# Altium project PCB_Stm.PrjPcb
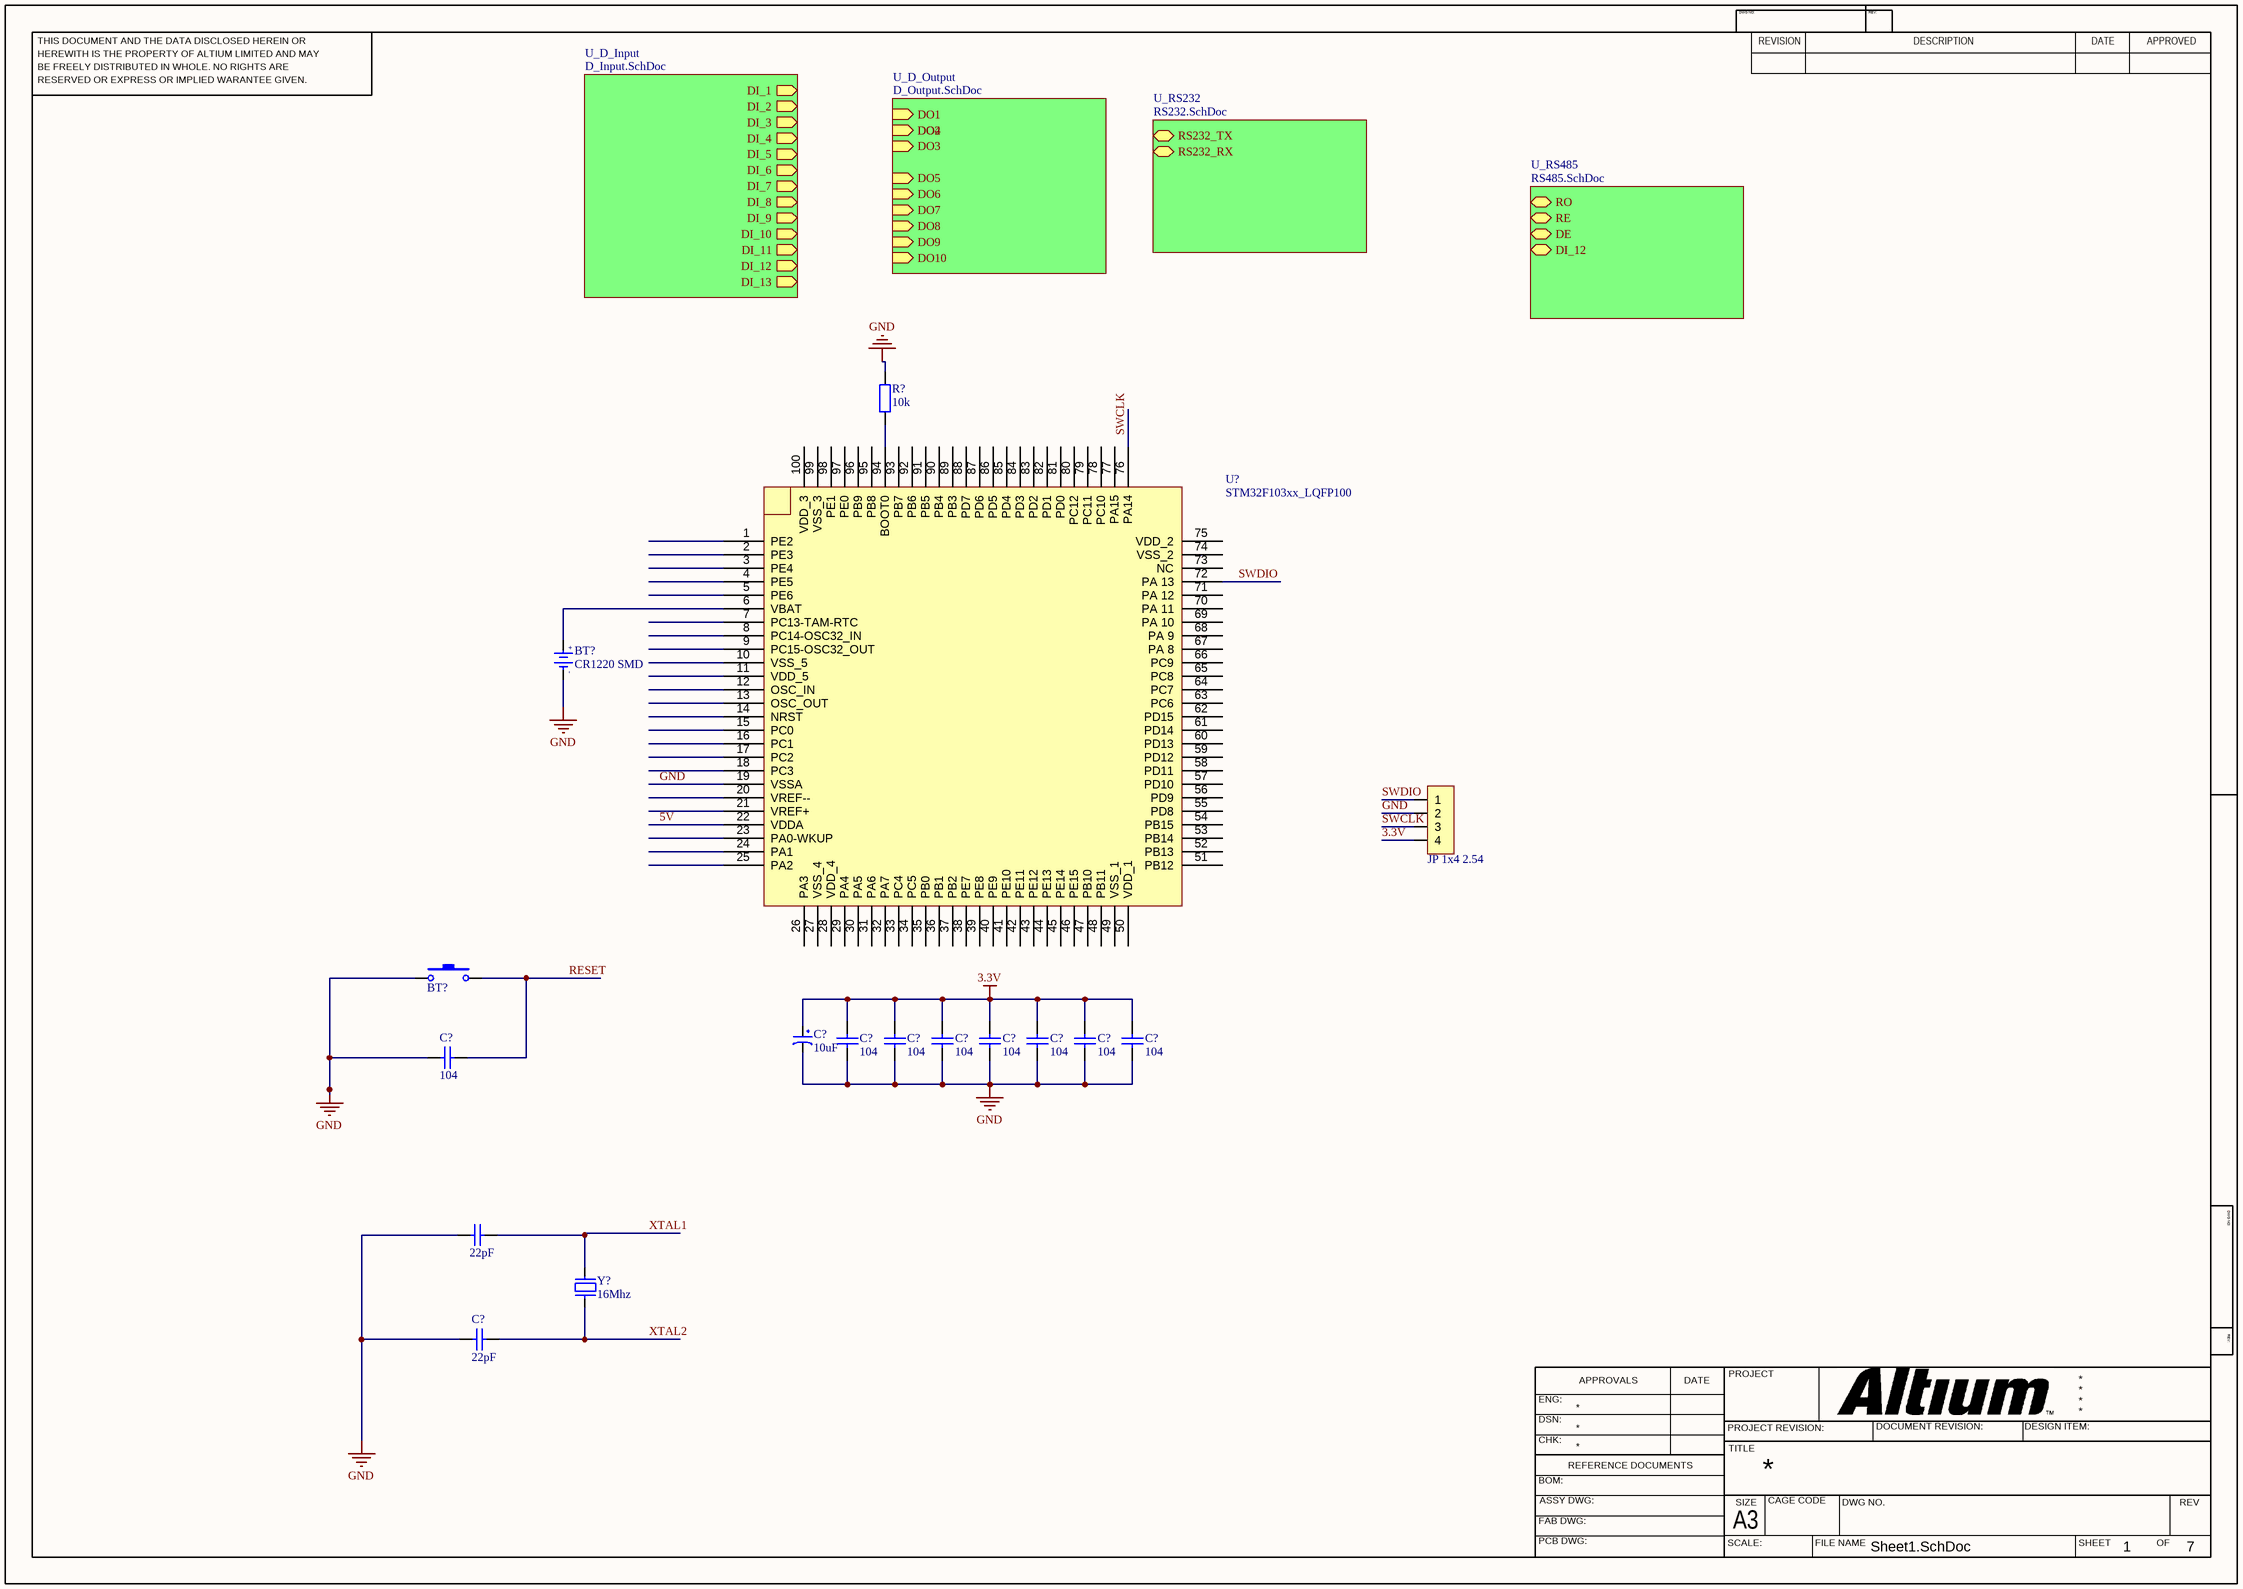
[diagram p0: Sheet1.SchDoc]
6 sheets, 106 parts. Net scope: hierarchical (ports join the sheet entries above them; power ports are global).
Board file: PCB1.PcbDoc
Sheets:
  Sheet1.SchDoc
    U_D_Input = D_Input.SchDoc
    U_D_Output = D_Output.SchDoc
    U_RS232 = RS232.SchDoc
  A_Input.SchDoc
  PWM_Output.SchDoc

## Sheet Sheet1.SchDoc
size 420 x 297 mm; SheetNumber: 1; SheetTotal: 7

### Parts
(Parts that share a designator on the sheet are numbered #1, #2 ... from top to bottom, then left to right.)
?  22pF  [tu 0805]
BT?#1  CR1220 SMD  [DE PIN CR1220]
BT?#2  Nut Nhan 2 Chan SMD 3x6x2.5  [Nut Nhan 2 Chan SMD 3x6x2.5]  (value not drawn)
C?#1  10uF  [tu tantalum smd3528]
C?#2  104  [tu 0805]
C?#3  104  [tu 0805]
C?#4  104  [tu 0805]
C?#5  104  [tu 0805]
C?#6  104  [tu 0805]
C?#7  104  [tu 0805]
C?#8  104  [tu 0805]
C?#9  104  [tu 0805]
C?#10  22pF  [tu 0805]
JP?  JP 1x4 2.54  [JP 1x4 DC]
R?#1  10k  [tro smd 0805]
U?#1  STM32F103xx_LQFP100  [STM32_LQFP100]
Y?  16Mhz  [Thach Anh 2 chan SMD]

### Sub-sheets
U_D_Input = D_Input.SchDoc: DI_1 (out), DI_2 (out), DI_3 (out), DI_4 (out), DI_5 (out), DI_6 (out), DI_7 (out), DI_8 (out), DI_9 (out), DI_10 (out), DI_11 (out), DI_12 (out), DI_13 (out)
U_D_Output = D_Output.SchDoc: DO1 (in), DO2 (in), DO3 (in), DO4 (in), DO5 (in), DO6 (in), DO7 (in), DO8 (in), DO9 (in), DO10 (in)
U_RS232 = RS232.SchDoc: RS232_TX (bidir), RS232_RX (bidir)
U_RS485 = RS485.SchDoc (file not in this document): RO (bidir), RE (bidir), DE (bidir), DI_12 (bidir)

### Nets
3.3V: C?#1.1 C?#2.1 C?#3.1 C?#4.1 C?#5.1 C?#6.1 C?#7.1 C?#8.1 JP?.4
GND: ?.1 BT?#1.2(GND) BT?#2.1 C?#1.2 C?#2.2 C?#3.2 C?#4.2 C?#5.2 C?#6.2 C?#7.2 C?#8.2 C?#9.1 C?#10.2 JP?.2 R?#1.2 U?#1.19(VSSA)
5V: U?#1.22(VDDA)
RESET: BT?#2.2 C?#9.2
SWCLK: JP?.3 U?#1.76(PA14)
SWDIO: JP?.1 U?#1.72(PA_13)
XTAL1: ?.2 Y?.2
XTAL2: C?#10.1 Y?.1
NetBT?#1_1: BT?#1.1(+3V) U?#1.6(VBAT)
NetR?#1_1: R?#1.1 U?#1.94(BOOT0)
NetR?#35_1: sheet U_D_Output/DO2, sheet U_D_Output/DO4

Not connected (* = marked no-connect by the designer): U?#1 1(PE2) 2(PE3) 3(PE4) 4(PE5) 5(PE6) 7(PC13-TAM-RTC) 8(PC14-OSC32_IN) 9(PC15-OSC32_OUT) 10(VSS_5) 11(VDD_5) 12(OSC_IN) 13(OSC_OUT) 14(NRST) 15(PC0) 16(PC1) 17(PC2) 18(PC3) 20(VREF--) 21(VREF+) 23(PA0-WKUP) 24(PA1) 25(PA2) 26(PA3) 27(VSS_4) 28(VDD_4) 29(PA4) 30(PA5) 31(PA6) 32(PA7) 33(PC4) 34(PC5) 35(PB0) 36(PB1) 37(PB2) 38(PE7) 39(PE8) 40(PE9) 41(PE10) 42(PE11) 43(PE12) 44(PE13) 45(PE14) 46(PE15) 47(PB10) 48(PB11) 49(VSS_1) 50(VDD_1) 51(PB12) 52(PB13) 53(PB14) 54(PB15) 55(PD8) 56(PD9) 57(PD10) 58(PD11) 59(PD12) 60(PD13) 61(PD14) 62(PD15) 63(PC6) 64(PC7) 65(PC8) 66(PC9) 67(PA_8) 68(PA_9) 69(PA_10) 70(PA_11) 71(PA_12) 73(NC) 74(VSS_2) 75(VDD_2) 77(PA15) 78(PC10) 79(PC11) 80(PC12) 81(PD0) 82(PD1) 83(PD2) 84(PD3) 85(PD4) 86(PD5) 87(PD6) 88(PD7) 89(PB3) 90(PB4) 91(PB5) 92(PB6) 93(PB7) 95(PB8) 96(PB9) 97(PE0) 98(PE1) 99(VSS_3) 100(VDD_3)

### Notes on the sheet
- THIS DOCUMENT AND THE DATA DISCLOSED HEREIN OR
- HEREWITH IS THE PROPERTY OF ALTIUM LIMITED AND MAY
- DWG NO:
- REVISION
- REV:
- DESCRIPTION
- DATE
- APPROVED
- BE FREELY DISTRIBUTED IN WHOLE. NO RIGHTS ARE
- RESERVED OR EXPRESS OR IMPLIED WARANTEE GIVEN.
- ENG:
- APPROVALS
- PROJECT
- DSN:
- CHK:
- REFERENCE DOCUMENTS
- PROJECT REVISION:
- TITLE
- DOCUMENT REVISION:
- DESIGN ITEM:
- BOM:
- FAB DWG:
- PCB DWG:
- ASSY DWG:
- SCALE:
- A3
- SIZE
- CAGE CODE
- FILE NAME
- DWG NO.
- SHEET
- OF
- REV
- (in symbol De pin CR1220 SMD) +; -

### Library data of the parts
? C?#10 = Tu 0805 22pF 50V 10%: Dán; Don_Vi: Con; So_Chan: 2; Ten_Linh_Kien: Tụ 0805 22P 10% 50V; Ma_Hang: MH004560; Chung_Loai: Dán; Kieu_Chan: *
BT?#1 = De pin CR1220 SMD: Ten: Đế PIN CR1220 SMD; Ma_Hang: MH000833
BT?#2 = Nut Nhan 2 Chan SMD 3x6x2.5: Ma_Hang: MH001036; Ten: Nút Nhấn 2 Chân 3x6x2.5MM SMD
C?#1 = Tu tantalum 10uF 16V SMD3528: Dán; Don_Vi: Con; So_Chan: 2; Ten_Linh_Kien: Tụ tantalum 106C-10uF 16V SMD3528; Ma_Hang: MH007474; Chung_Loai: Dán; Kieu_Chan: *
C?#2-C?#9 = Tu 0805 104 50V 10%: Dán; Don_Vi: Con; So_Chan: 2; Ten_Linh_Kien: Tụ 0805 104-100nF 10% 50V; Ma_Hang: MH004551; Chung_Loai: Dán; Kieu_Chan: *
JP? = JP 1x4 2.54 Duc Cong: Cắm; Ten_Linh_Kien: Jump Đơn Đực 2.54MM 1x40P Cong Đứng; Don_Vi: Con; Ma_Hang: MH000904; Ghi_Chu: *; Kieu_Chan: *; Chung_Loai: Cắm
R?#1 = Tro 0805 5% 10k: Dán; Don_Vi: Con; So_Chan: 2; Ten_Linh_Kien: Trở 0805 5% 10k; Ma_Hang: MH005239; Chung_Loai: Dán; Kieu_Chan: *
Y? = Thach Anh 2 chan SMD: Crystal For all Crystal 2pin.; Value: 4Mhz

## Sheet D_Input.SchDoc
size 420 x 297 mm; SheetNumber: 2; SheetTotal: 5
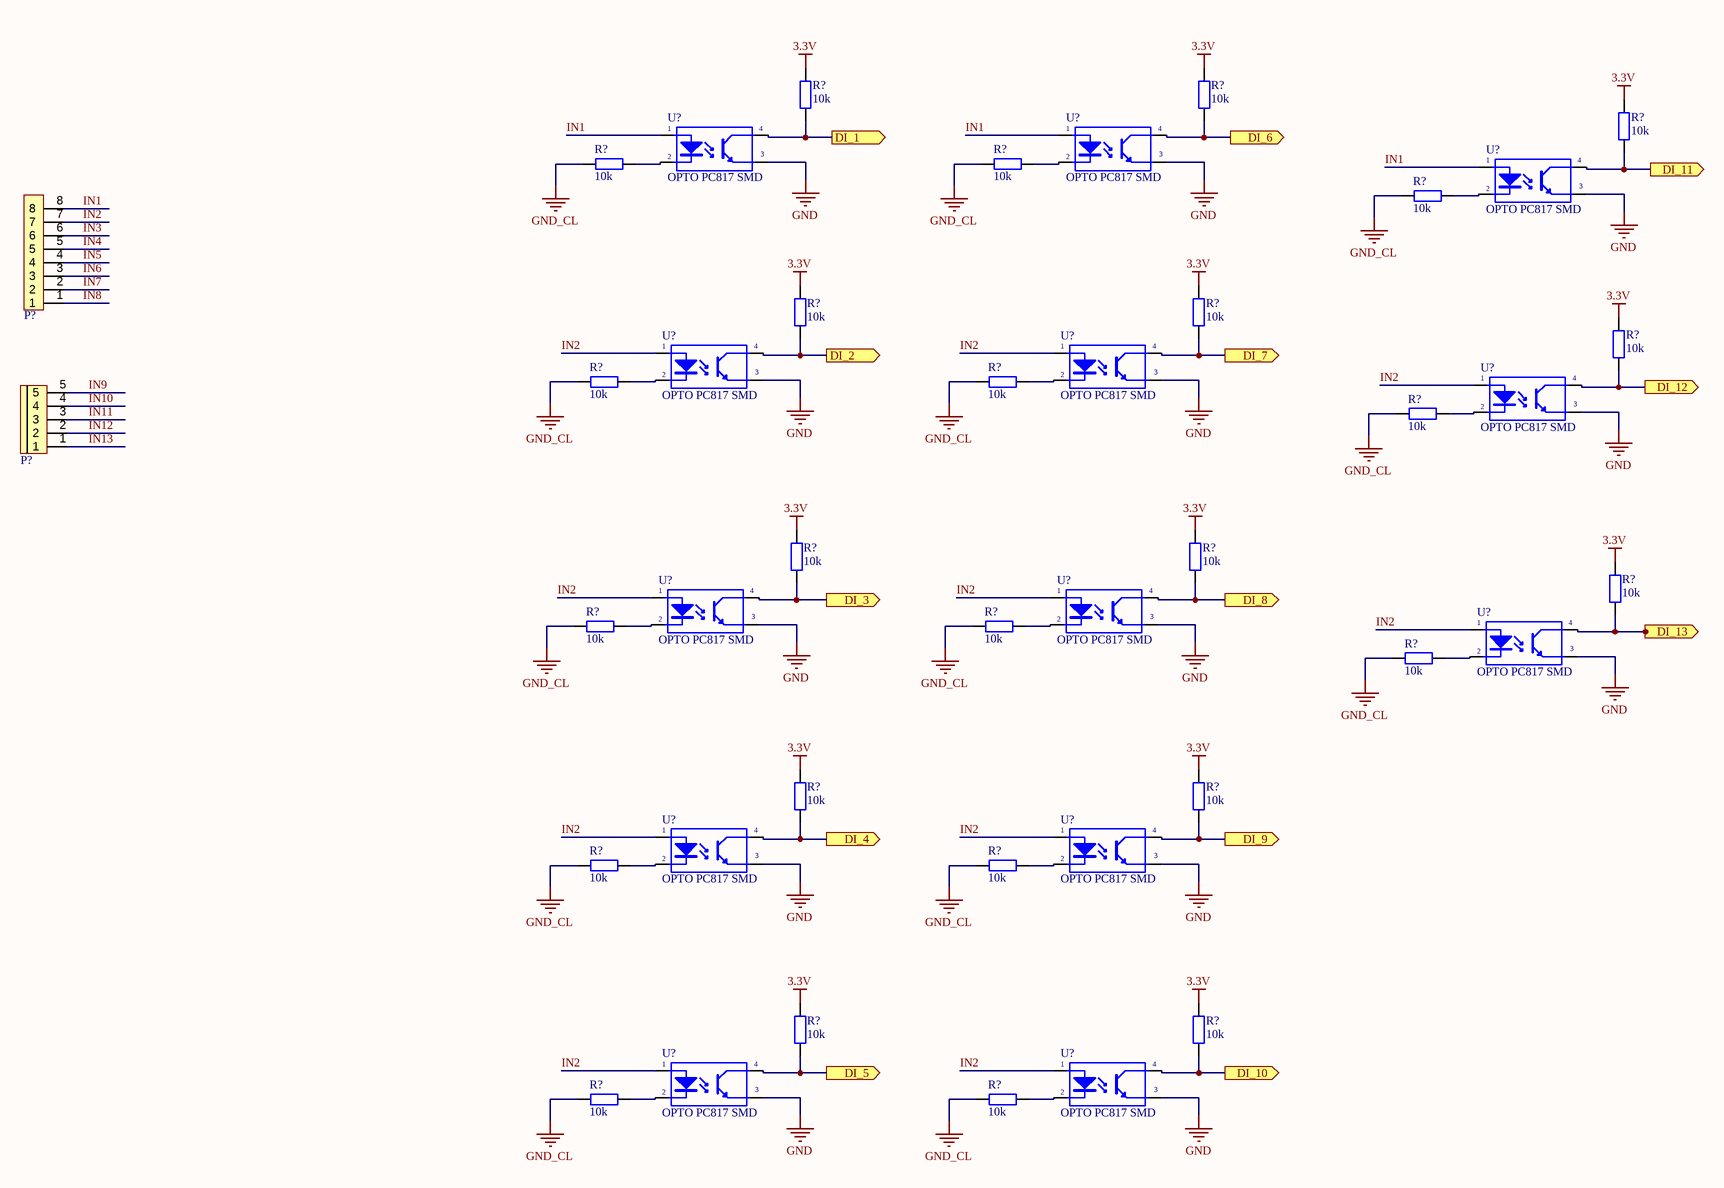
[diagram p1: D_Input.SchDoc]

### Parts
(Parts that share a designator on the sheet are numbered #1, #2 ... from top to bottom, then left to right.)
P?#1  CON 8 EDG5.08  [CON 8 8EDG5.08]  (value not drawn)
P?#2  CON 5 EDG5.08  [CON 5 5EDG5.08]  (value not drawn)
R?#2  10k  [tro smd 0805]
R?#3  10k  [tro smd 0805]
R?#4  10k  [tro smd 0805]
R?#5  10k  [tro smd 0805]
R?#6  10k  [tro smd 0805]
R?#7  10k  [tro smd 0805]
R?#8  10k  [tro smd 0805]
R?#9  10k  [tro smd 0805]
R?#10  10k  [tro smd 0805]
R?#11  10k  [tro smd 0805]
R?#12  10k  [tro smd 0805]
R?#13  10k  [tro smd 0805]
R?#14  10k  [tro smd 0805]
R?#15  10k  [tro smd 0805]
R?#16  10k  [tro smd 0805]
R?#17  10k  [tro smd 0805]
R?#18  10k  [tro smd 0805]
R?#19  10k  [tro smd 0805]
R?#20  10k  [tro smd 0805]
R?#21  10k  [tro smd 0805]
R?#22  10k  [tro smd 0805]
R?#23  10k  [tro smd 0805]
R?#24  10k  [tro smd 0805]
R?#25  10k  [tro smd 0805]
R?#26  10k  [tro smd 0805]
R?#27  10k  [tro smd 0805]
U?#2  OPTO PC817 SMD  [SOP4]
U?#3  OPTO PC817 SMD  [SOP4]
U?#4  OPTO PC817 SMD  [SOP4]
U?#5  OPTO PC817 SMD  [SOP4]
U?#6  OPTO PC817 SMD  [SOP4]
U?#7  OPTO PC817 SMD  [SOP4]
U?#8  OPTO PC817 SMD  [SOP4]
U?#9  OPTO PC817 SMD  [SOP4]
U?#10  OPTO PC817 SMD  [SOP4]
U?#11  OPTO PC817 SMD  [SOP4]
U?#12  OPTO PC817 SMD  [SOP4]
U?#13  OPTO PC817 SMD  [SOP4]
U?#14  OPTO PC817 SMD  [SOP4]

### Ports
DI_1 (out), DI_2 (out), DI_3 (out), DI_4 (out), DI_5 (out), DI_6 (out), DI_7 (out), DI_8 (out), DI_9 (out), DI_10 (out), DI_11 (out), DI_12 (out), DI_13 (out)

### Nets
3.3V: R?#2.1 R?#3.1 R?#4.1 R?#8.1 R?#9.1 R?#10.1 R?#14.1 R?#15.1 R?#16.1 R?#20.1 R?#21.1 R?#24.1 R?#25.1
GND: U?#2.3(E) U?#3.3(E) U?#4.3(E) U?#5.3(E) U?#6.3(E) U?#7.3(E) U?#8.3(E) U?#9.3(E) U?#10.3(E) U?#11.3(E) U?#12.3(E) U?#13.3(E) U?#14.3(E)
GND_CL: R?#5.2 R?#6.2 R?#7.2 R?#11.2 R?#12.2 R?#13.2 R?#17.2 R?#18.2 R?#19.2 R?#22.2 R?#23.2 R?#26.2 R?#27.2
IN1: P?#1.8 U?#2.1(A) U?#3.1(A) U?#4.1(A)
IN2: P?#1.7 U?#5.1(A) U?#6.1(A) U?#7.1(A) U?#8.1(A) U?#9.1(A) U?#10.1(A) U?#11.1(A) U?#12.1(A) U?#13.1(A) U?#14.1(A)
IN3: P?#1.6
IN4: P?#1.5
IN5: P?#1.4
IN6: P?#1.3
IN7: P?#1.2
IN8: P?#1.1
IN9: P?#2.5
IN10: P?#2.4
IN11: P?#2.3
IN12: P?#2.2
IN13: P?#2.1
NetR?#2_2: R?#2.2 U?#2.4(C) ; port DI_1
NetR?#3_2: R?#3.2 U?#3.4(C) ; port DI_6
NetR?#4_2: R?#4.2 U?#4.4(C) ; port DI_11
NetR?#5_1: R?#5.1 U?#2.2(K)
NetR?#6_1: R?#6.1 U?#3.2(K)
NetR?#7_1: R?#7.1 U?#4.2(K)
NetR?#8_2: R?#8.2 U?#5.4(C) ; port DI_2
NetR?#9_2: R?#9.2 U?#6.4(C) ; port DI_7
NetR?#10_2: R?#10.2 U?#7.4(C) ; port DI_12
NetR?#11_1: R?#11.1 U?#5.2(K)
NetR?#12_1: R?#12.1 U?#6.2(K)
NetR?#13_1: R?#13.1 U?#7.2(K)
NetR?#14_2: R?#14.2 U?#8.4(C) ; port DI_3
NetR?#15_2: R?#15.2 U?#9.4(C) ; port DI_8
NetR?#16_2: R?#16.2 U?#10.4(C) ; port DI_13
NetR?#17_1: R?#17.1 U?#8.2(K)
NetR?#18_1: R?#18.1 U?#9.2(K)
NetR?#19_1: R?#19.1 U?#10.2(K)
NetR?#20_2: R?#20.2 U?#11.4(C) ; port DI_4
NetR?#21_2: R?#21.2 U?#12.4(C) ; port DI_9
NetR?#22_1: R?#22.1 U?#11.2(K)
NetR?#23_1: R?#23.1 U?#12.2(K)
NetR?#24_2: R?#24.2 U?#13.4(C) ; port DI_5
NetR?#25_2: R?#25.2 U?#14.4(C) ; port DI_10
NetR?#26_1: R?#26.1 U?#13.2(K)
NetR?#27_1: R?#27.1 U?#14.2(K)

### Notes on the sheet
- THIS DOCUMENT AND THE DATA DISCLOSED HEREIN OR
- HEREWITH IS THE PROPERTY OF ALTIUM LIMITED AND MAY
- DWG NO:
- REVISION
- REV:
- DESCRIPTION
- DATE
- APPROVED
- BE FREELY DISTRIBUTED IN WHOLE. NO RIGHTS ARE
- RESERVED OR EXPRESS OR IMPLIED WARANTEE GIVEN.
- ENG:
- APPROVALS
- PROJECT
- DSN:
- CHK:
- REFERENCE DOCUMENTS
- PROJECT REVISION:
- TITLE
- DOCUMENT REVISION:
- DESIGN ITEM:
- BOM:
- FAB DWG:
- PCB DWG:
- ASSY DWG:
- SCALE:
- A3
- SIZE
- CAGE CODE
- FILE NAME
- DWG NO.
- SHEET
- OF
- REV

### Library data of the parts
P?#1 = CON 8 EDG5.08: Cắm; Ten_Linh_Kien: CON 8 2EDG5.08-8P 5.08MM ( Xanh Cong); Ma_Hang: MH000978; Don_Vi: Con; Ghi_Chu: *; Kieu_Chan: *; Chung_Loai: Cắm
P?#2 = CON 5 EDG5.08: Cắm; Ten_Linh_Kien: CON 5 2EDG5.08-5P 5.08MM ( Xanh Cong); Ma_Hang: MH003589; Kieu_Chan: *; Don_Vi: Con; Ghi_Chu: *; Chung_Loai: Cắm
R?#2-R?#27 = Tro 0805 5% 10k: as R?#1 on sheet Sheet1; Chung_Loai: Dán; Kieu_Chan: *
U?#2-U?#14 = OPTO PC817 SMD: Single Opto; Value: PC817

## Sheet D_Output.SchDoc
size 420 x 297 mm; SheetNumber: 4; SheetTotal: 5
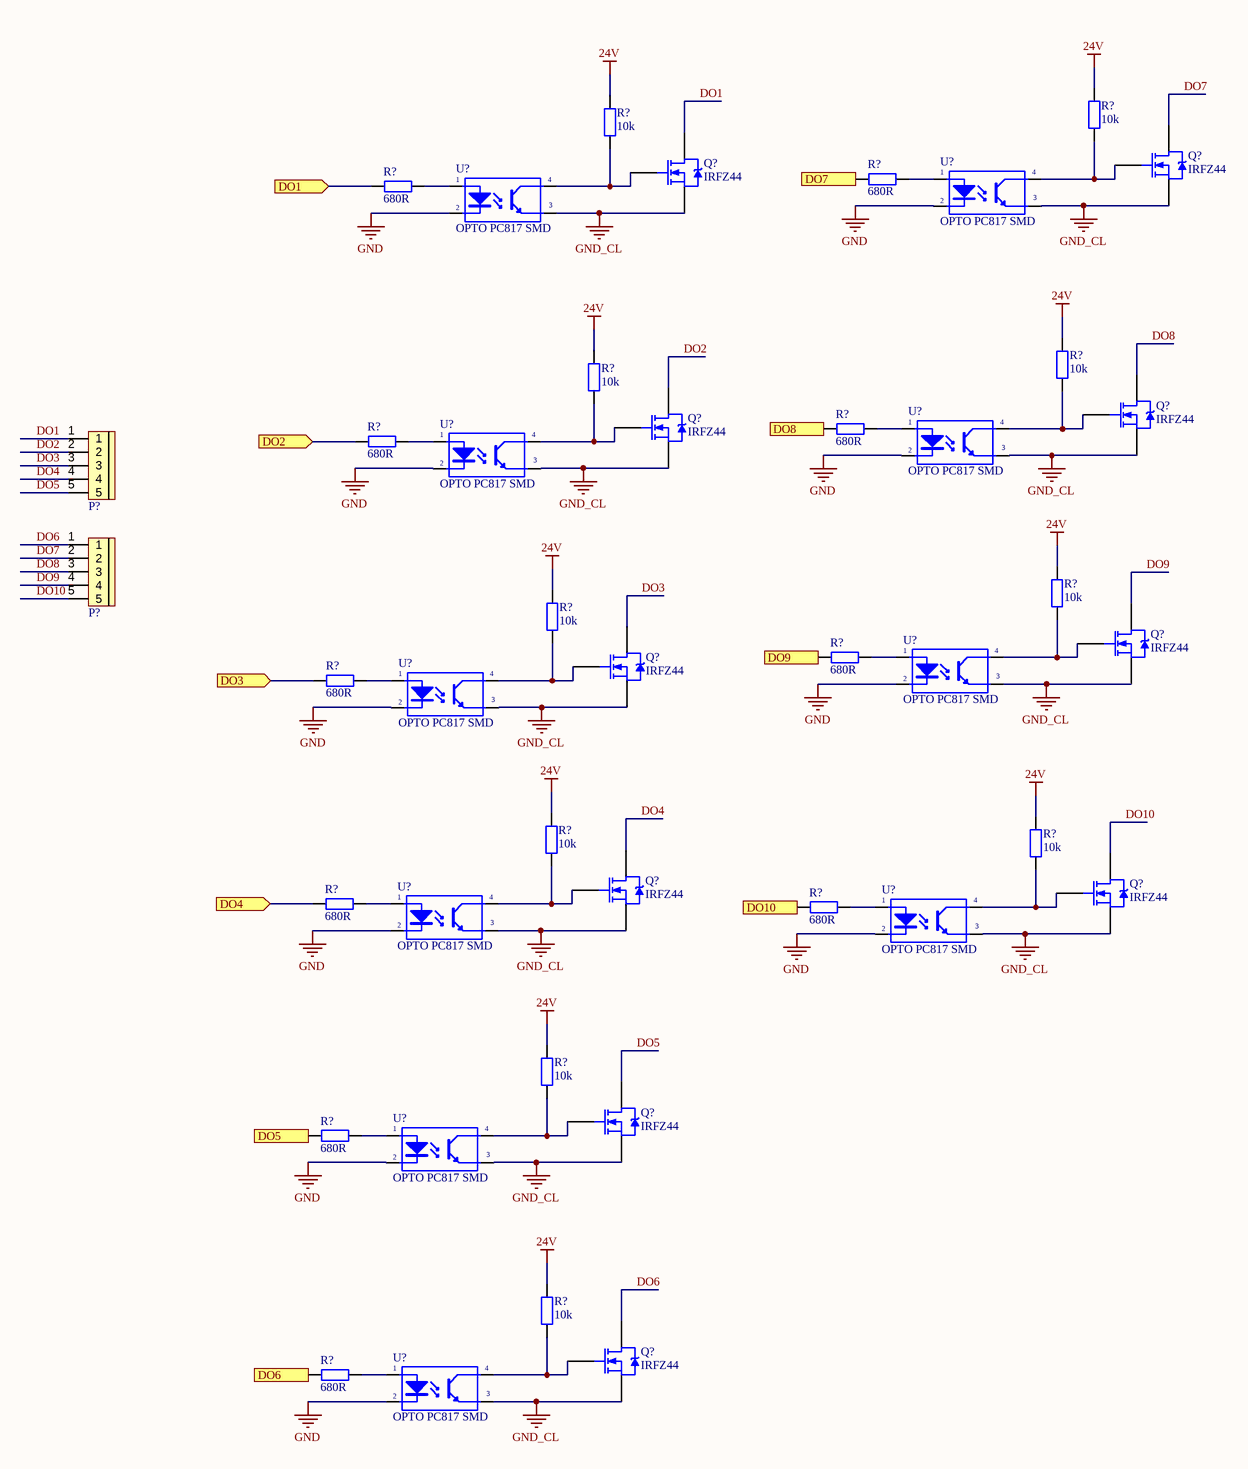
[diagram p2: D_Output.SchDoc]

### Parts
(Parts that share a designator on the sheet are numbered #1, #2 ... from top to bottom, then left to right.)
P?#3  CON 5 EDG5.08  [CON 5 5EDG5.08]  (value not drawn)
P?#4  CON 5 EDG5.08  [CON 5 5EDG5.08]  (value not drawn)
Q?#1  IRFZ44  [TO220]
Q?#2  IRFZ44  [TO220]
Q?#3  IRFZ44  [TO220]
Q?#4  IRFZ44  [TO220]
Q?#5  IRFZ44  [TO220]
Q?#6  IRFZ44  [TO220]
Q?#7  IRFZ44  [TO220]
Q?#8  IRFZ44  [TO220]
Q?#9  IRFZ44  [TO220]
Q?#10  IRFZ44  [TO220]
R?#28  10k  [tro smd 0805]
R?#29  10k  [tro smd 0805]
R?#30  680R  [Tro SMD 0805]
R?#31  680R  [Tro SMD 0805]
R?#32  10k  [tro smd 0805]
R?#33  10k  [tro smd 0805]
R?#34  680R  [Tro SMD 0805]
R?#35  680R  [Tro SMD 0805]
R?#36  10k  [tro smd 0805]
R?#37  10k  [tro smd 0805]
R?#38  680R  [Tro SMD 0805]
R?#39  680R  [Tro SMD 0805]
R?#40  10k  [tro smd 0805]
R?#41  10k  [tro smd 0805]
R?#42  680R  [Tro SMD 0805]
R?#43  680R  [Tro SMD 0805]
R?#44  10k  [tro smd 0805]
R?#45  680R  [Tro SMD 0805]
R?#46  10k  [tro smd 0805]
R?#47  680R  [Tro SMD 0805]
U?#15  OPTO PC817 SMD  [SOP4]
U?#16  OPTO PC817 SMD  [SOP4]
U?#17  OPTO PC817 SMD  [SOP4]
U?#18  OPTO PC817 SMD  [SOP4]
U?#19  OPTO PC817 SMD  [SOP4]
U?#20  OPTO PC817 SMD  [SOP4]
U?#21  OPTO PC817 SMD  [SOP4]
U?#22  OPTO PC817 SMD  [SOP4]
U?#23  OPTO PC817 SMD  [SOP4]
U?#24  OPTO PC817 SMD  [SOP4]

### Ports
DO1 (in), DO2 (in), DO3 (in), DO4 (in), DO5 (in), DO6 (in), DO7 (in), DO8 (in), DO9 (in), DO10 (in)

### Nets
24V: R?#28.1 R?#29.1 R?#32.1 R?#33.1 R?#36.1 R?#37.1 R?#40.1 R?#41.1 R?#44.1 R?#46.1
GND: U?#15.2(K) U?#16.2(K) U?#17.2(K) U?#18.2(K) U?#19.2(K) U?#20.2(K) U?#21.2(K) U?#22.2(K) U?#23.2(K) U?#24.2(K)
GND_CL: Q?#1.3(S) Q?#2.3(S) Q?#3.3(S) Q?#4.3(S) Q?#5.3(S) Q?#6.3(S) Q?#7.3(S) Q?#8.3(S) Q?#9.3(S) Q?#10.3(S) U?#15.3(E) U?#16.3(E) U?#17.3(E) U?#18.3(E) U?#19.3(E) U?#20.3(E) U?#21.3(E) U?#22.3(E) U?#23.3(E) U?#24.3(E)
DO1: P?#3.1 Q?#2.2(D)
DO2: P?#3.2 Q?#4.2(D)
DO3: P?#3.3 Q?#6.2(D)
DO4: P?#3.4 Q?#7.2(D)
DO5: P?#3.5 Q?#9.2(D)
DO6: P?#4.1 Q?#10.2(D)
DO7: P?#4.2 Q?#1.2(D)
DO8: P?#4.3 Q?#3.2(D)
DO9: P?#4.4 Q?#5.2(D)
DO10: P?#4.5 Q?#8.2(D)
NetQ?#1_1: Q?#1.1(G) R?#28.2 U?#15.4(C)
NetQ?#2_1: Q?#2.1(G) R?#29.2 U?#16.4(C)
NetQ?#3_1: Q?#3.1(G) R?#32.2 U?#17.4(C)
NetQ?#4_1: Q?#4.1(G) R?#33.2 U?#18.4(C)
NetQ?#5_1: Q?#5.1(G) R?#36.2 U?#19.4(C)
NetQ?#6_1: Q?#6.1(G) R?#37.2 U?#20.4(C)
NetQ?#7_1: Q?#7.1(G) R?#40.2 U?#21.4(C)
NetQ?#8_1: Q?#8.1(G) R?#41.2 U?#22.4(C)
NetQ?#9_1: Q?#9.1(G) R?#44.2 U?#23.4(C)
NetQ?#10_1: Q?#10.1(G) R?#46.2 U?#24.4(C)
NetR?#30_1: R?#30.1 ; port DO7
NetR?#30_2: R?#30.2 U?#15.1(A)
NetR?#31_1: R?#31.1 ; port DO1
NetR?#31_2: R?#31.2 U?#16.1(A)
NetR?#34_1: R?#34.1 ; port DO8
NetR?#34_2: R?#34.2 U?#17.1(A)
NetR?#35_1: R?#35.1 R?#42.1 ; port DO2, port DO4
NetR?#35_2: R?#35.2 U?#18.1(A)
NetR?#38_1: R?#38.1 ; port DO9
NetR?#38_2: R?#38.2 U?#19.1(A)
NetR?#39_1: R?#39.1 ; port DO3
NetR?#39_2: R?#39.2 U?#20.1(A)
NetR?#42_2: R?#42.2 U?#21.1(A)
NetR?#43_1: R?#43.1 ; port DO10
NetR?#43_2: R?#43.2 U?#22.1(A)
NetR?#45_1: R?#45.1 ; port DO5
NetR?#45_2: R?#45.2 U?#23.1(A)
NetR?#47_1: R?#47.1 ; port DO6
NetR?#47_2: R?#47.2 U?#24.1(A)

### Notes on the sheet
- THIS DOCUMENT AND THE DATA DISCLOSED HEREIN OR
- HEREWITH IS THE PROPERTY OF ALTIUM LIMITED AND MAY
- DWG NO:
- REVISION
- REV:
- DESCRIPTION
- DATE
- APPROVED
- BE FREELY DISTRIBUTED IN WHOLE. NO RIGHTS ARE
- RESERVED OR EXPRESS OR IMPLIED WARANTEE GIVEN.
- ENG:
- APPROVALS
- PROJECT
- DSN:
- CHK:
- REFERENCE DOCUMENTS
- PROJECT REVISION:
- TITLE
- DOCUMENT REVISION:
- DESIGN ITEM:
- BOM:
- FAB DWG:
- PCB DWG:
- ASSY DWG:
- SCALE:
- A3
- SIZE
- CAGE CODE
- FILE NAME
- DWG NO.
- SHEET
- OF
- REV

### Library data of the parts
P?#3 P?#4 = CON 5 EDG5.08: as P?#2 on sheet D_Input; Kieu_Chan: *; Don_Vi: Con; Ghi_Chu: *; Chung_Loai: Cắm
Q?#1-Q?#10 = FET IRFZ44 DIP: TO-220
R?#28 R?#29 R?#32 R?#33 R?#36 R?#37 R?#40 R?#41 R?#44 R?#46 = Tro 0805 5% 10k: as R?#1 on sheet Sheet1; Chung_Loai: Dán; Kieu_Chan: *
R?#30 R?#31 R?#34 R?#35 R?#38 R?#39 R?#42 R?#43 R?#45 R?#47 = Tro 0805 5% 680R: Dán; Don_Vi: Con; Ma_Hang: MH005344; So_Chan: 2; Ten_Linh_Kien: Trở 0805 5% 680R; Chung_Loai: Dán; Kieu_Chan: *
U?#15-U?#24 = OPTO PC817 SMD: Single Opto; Value: PC817

## Sheet RS232.SchDoc
size A; SheetNumber: 4; SheetTotal: 7
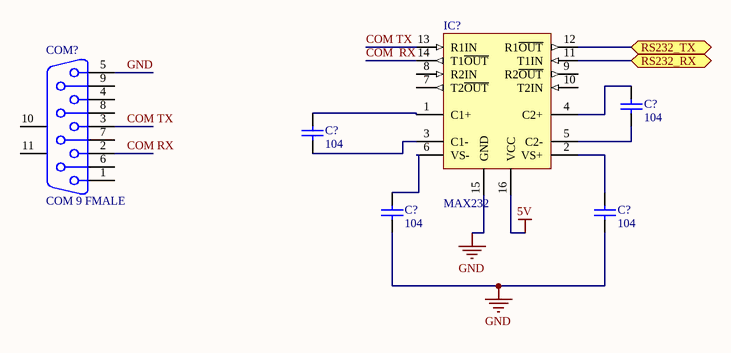
[diagram p3: RS232.SchDoc]

### Parts
(Parts that share a designator on the sheet are numbered #1, #2 ... from top to bottom, then left to right.)
C?#11  104  [tu 0805]
C?#12  104  [tu 0805]
C?#13  104  [tu 0805]
C?#14  104  [tu 0805]
COM?  COM 9 FMALE  [DSB 9-F]
IC?  MAX232  [DIP16/W0.3]

### Ports
RS232_RX (bidir), RS232_TX (bidir)

### Nets
5V: IC?.16(VCC)
GND: C?#13.2 C?#14.2 COM?.5 IC?.15(GND)
COM  RX: IC?.14(T1~{OUT})
COM RX: COM?.2
COM TX: COM?.3 IC?.13(R1IN)
NetC?#11_1: C?#11.1 IC?.4(C2+)
NetC?#11_2: C?#11.2 IC?.5(C2-)
NetC?#12_1: C?#12.1 IC?.1(C1+)
NetC?#12_2: C?#12.2 IC?.3(C1-)
NetC?#13_1: C?#13.1 IC?.6(VS-)
NetC?#14_1: C?#14.1 IC?.2(VS+)
NetIC?_11: IC?.11(T1IN) ; port RS232_RX
NetIC?_12: IC?.12(R1~{OUT}) ; port RS232_TX

Not connected (* = marked no-connect by the designer): COM? 1 4 6 7 8 9 10(MH1) 11(MH2); IC? 7(T2~{OUT}) 8(R2IN) 9(R2~{OUT}) 10(T2IN)

### Library data of the parts
C?#11-C?#14 = Tu 0805 104 50V 10%: as C?#2 on sheet Sheet1; Chung_Loai: Dán; Kieu_Chan: *
COM? = DSB9F: COM 9; PackageDocument: O; Positions: 9; Gender: Receptacle; Value: COM 9; Published: 15-Jun-2001; LatestRevisionDate: 17-Jul-2002; LatestRevisionNote: Re-released for DXP Platform.; DatasheetDocument: 1-Sep-1999; PackageReference: 788750; Publisher: Altium Limited; Orientation: Right Angle
IC? = MAX232: Dual EIA-232 Driver/Receiver; Value: MAX232

## Sheet A_Input.SchDoc
size A; SheetNumber: 3; SheetTotal: 3

## Sheet PWM_Output.SchDoc
size A; SheetNumber: 5; SheetTotal: 5

## Nets that join several sheets
3.3V: Sheet1 (9 pins), D_Input (13 pins)
GND: Sheet1 (16 pins), D_Input (13 pins), D_Output (10 pins), RS232 (C?#13.2 C?#14.2 COM?.5 IC?.15)
GND_CL: D_Input (13 pins), D_Output (20 pins)